# EAGLE design untitled (EAGLE 9.5.2)
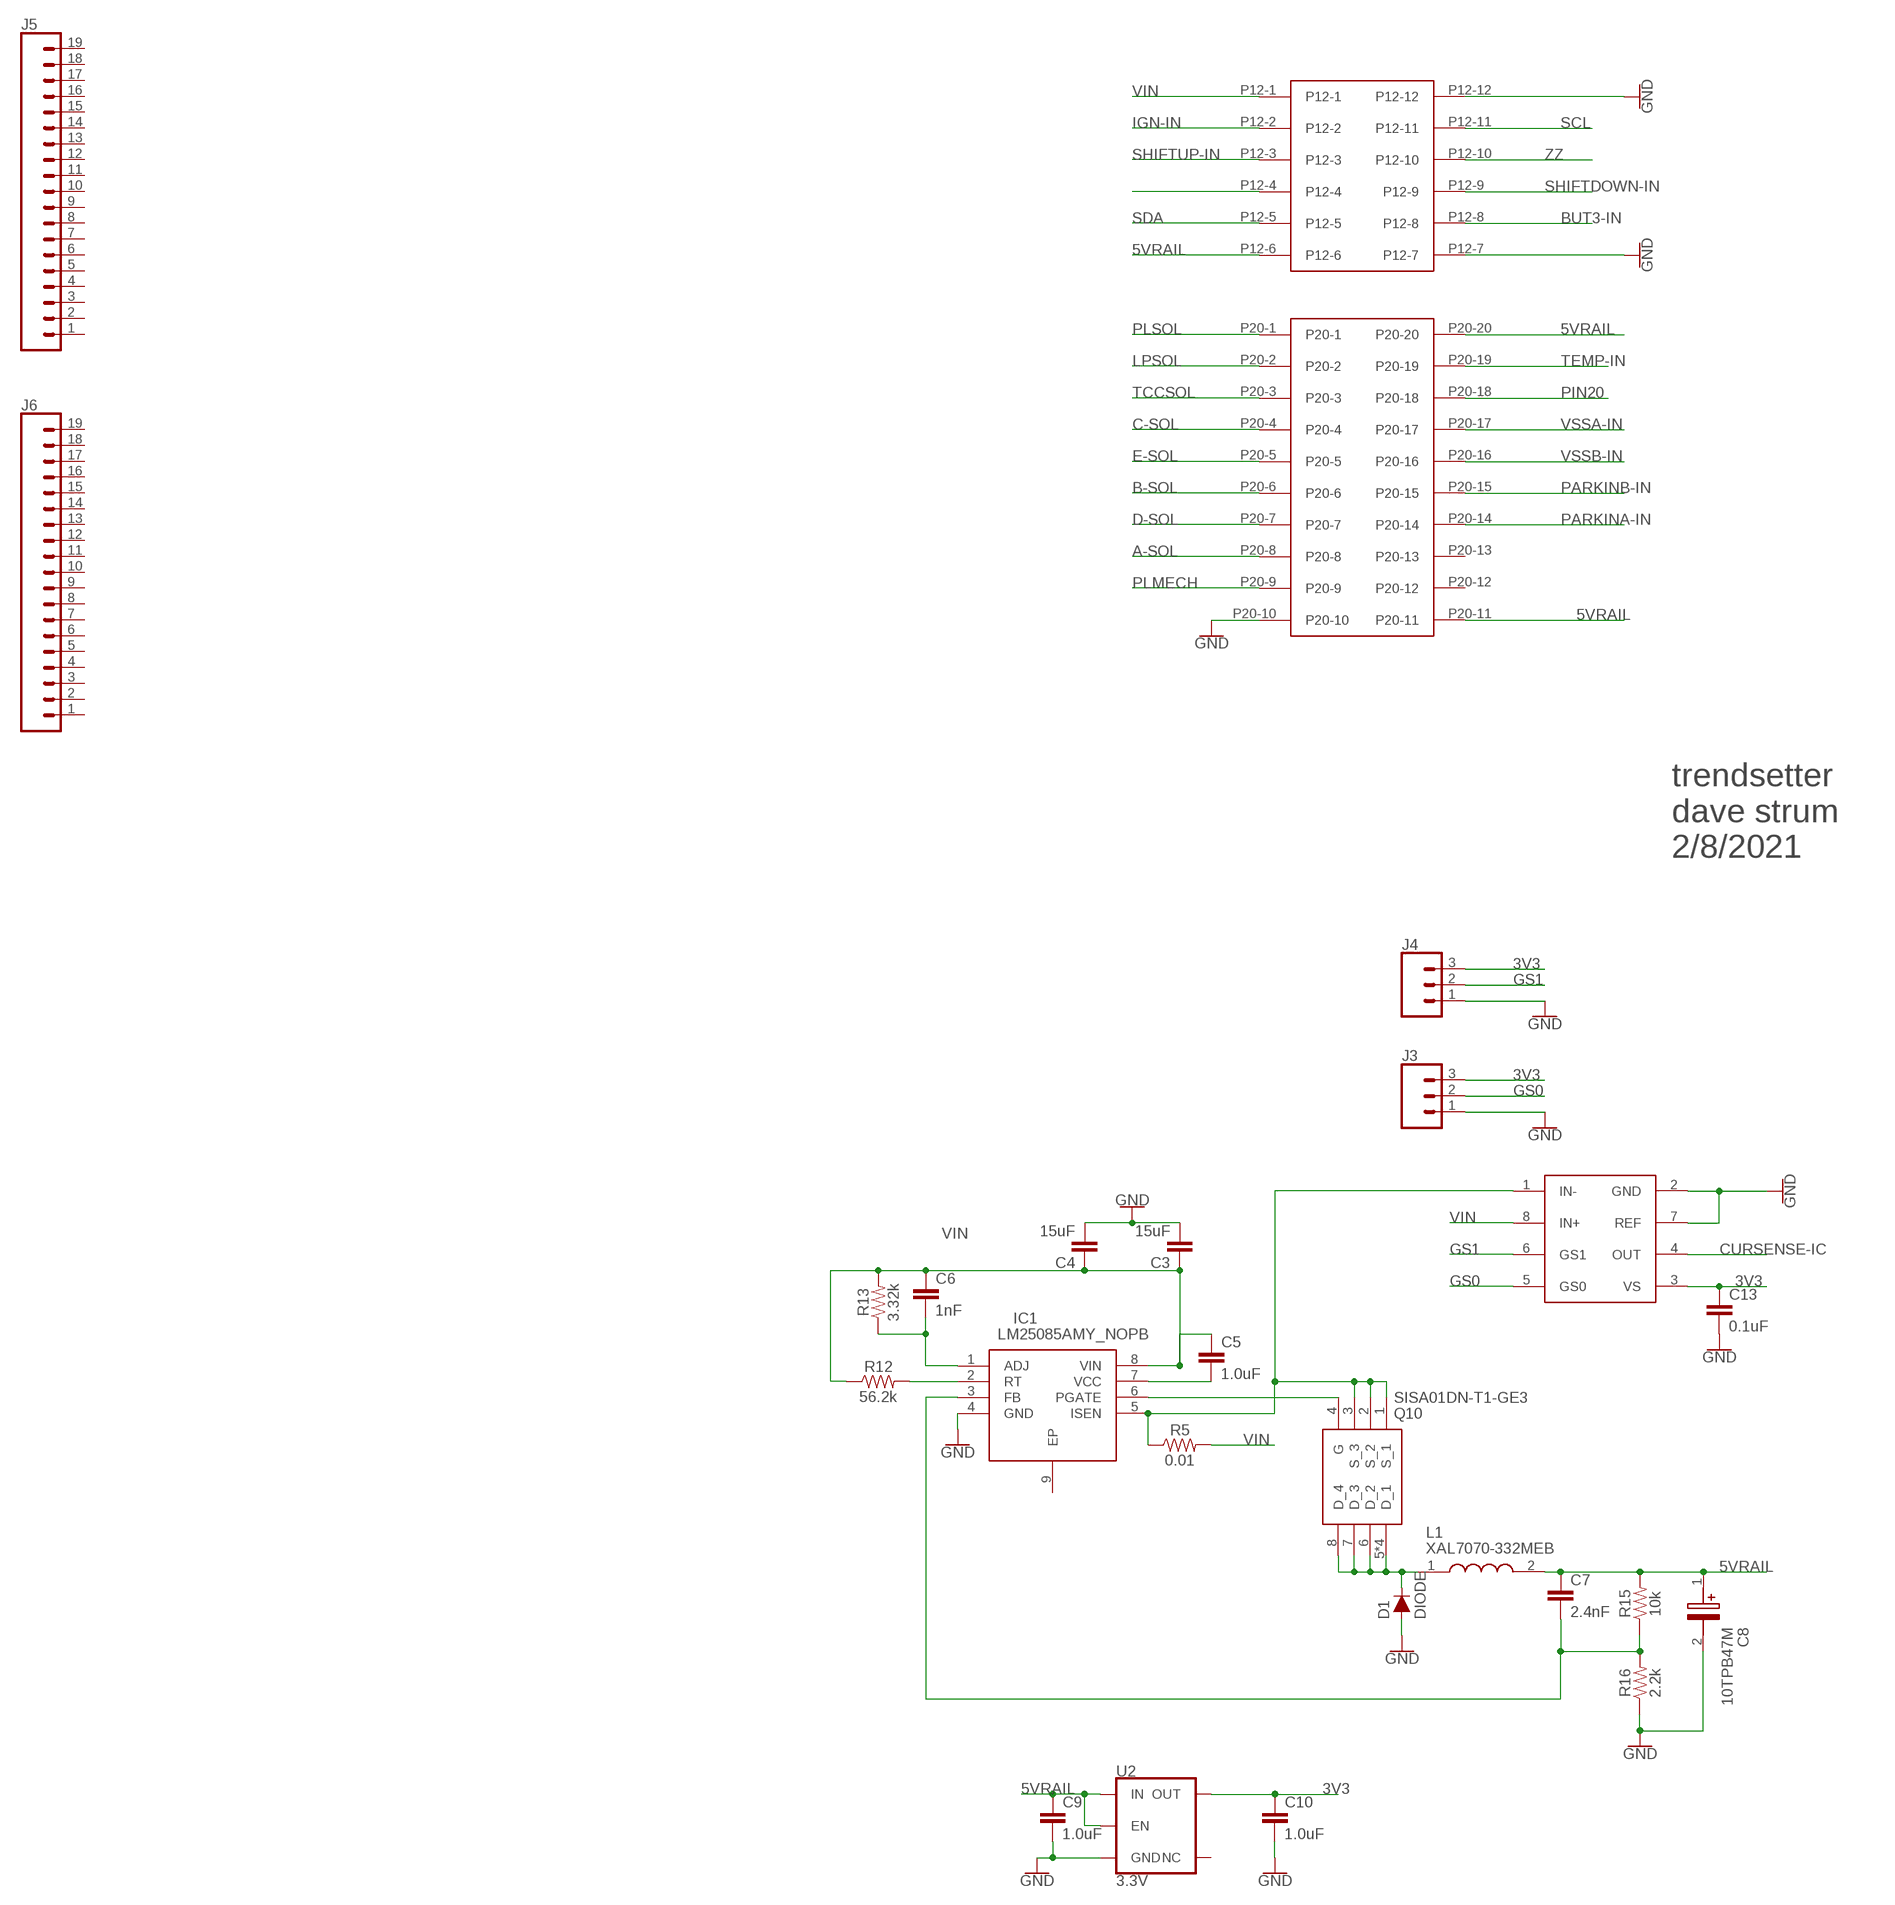
[diagram p0: schematic, sheet 1, part 1 of 2]
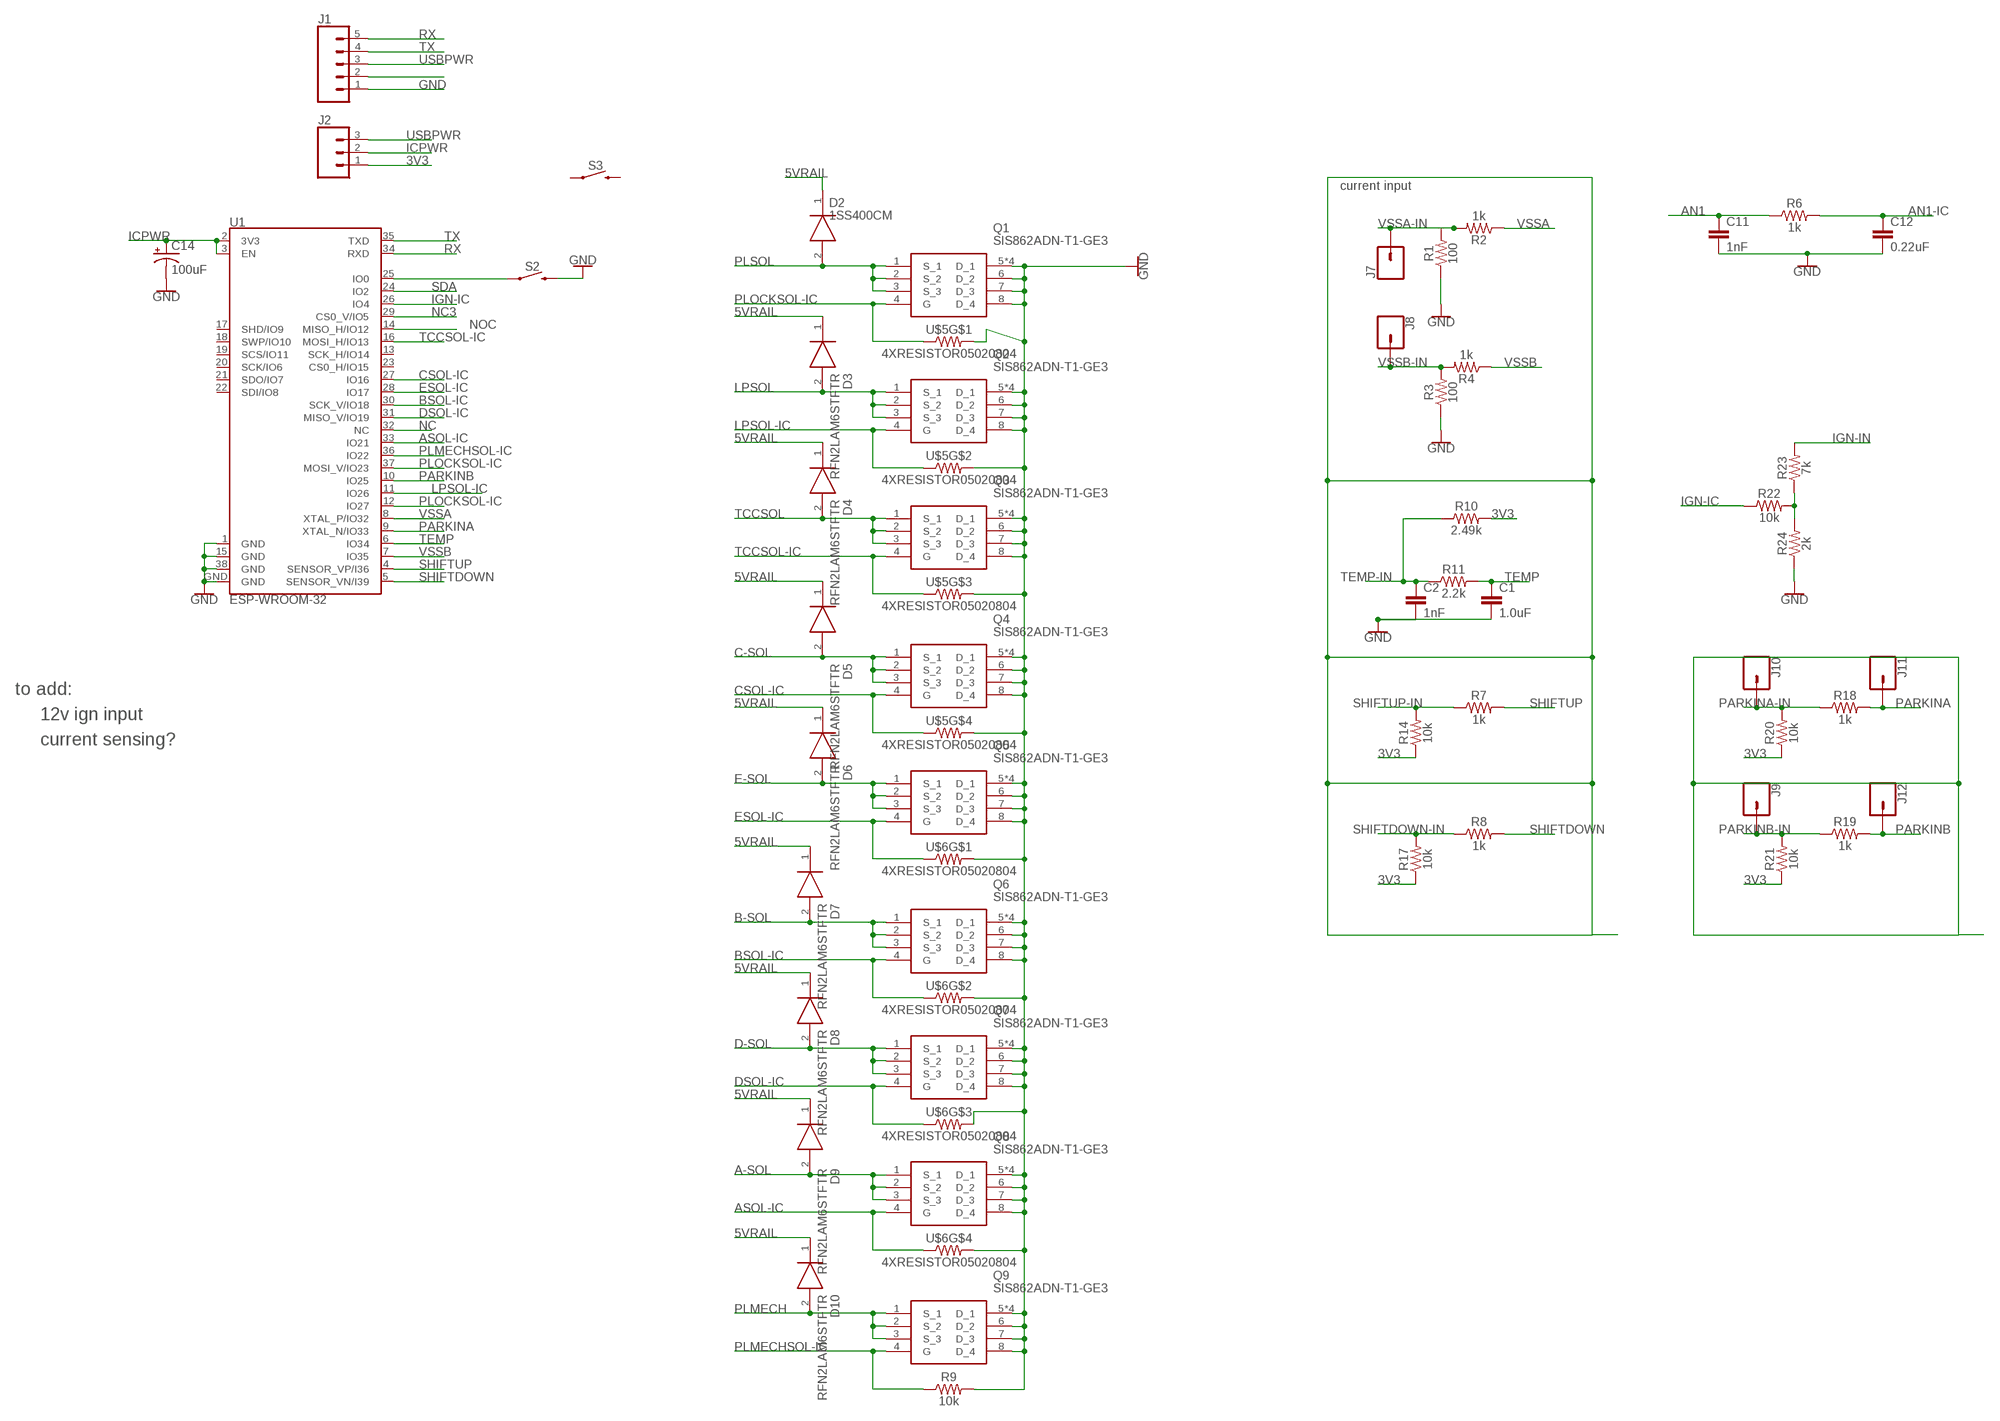
[diagram p1: schematic, sheet 1, part 2 of 2]

## Parts
C1  1.0uF  1.0UF-0603-16V-10%  [0603]
C2  1nF  1.0NF/1000PF-0603-50V-10%  [0603]
C3  15uF  10UF-0805-10V-10%  [0805]
C4  15uF  10UF-0805-10V-10%  [0805]
C5  1.0uF  1.0UF-0603-16V-10%-X7R  [0603]
C6  1nF  1.0NF/1000PF-0603-50V-10%  [0603]
C7  2.4nF  2.2UF-0603-10V-20%  [0603]
C8  10TPB47M  [CAPPM3528X210N]
C9  1.0uF  1.0UF-0603-16V-10%  [0603]
C10  1.0uF  1.0UF-0603-16V-10%  [0603]
C11  1nF  1.0NF/1000PF-0603-50V-10%  [0603]
C12  0.22uF  2.2UF-0603-10V-20%  [0603]
C13  0.1uF  0.1UF-0603-25V-5%  [0603]
C14  100uF  100UF-POLAR-EIA7343-10V-10%(TANT)  [EIA7343]
D1  DIODE  [DPAK]
D2  1SS400CM  RFN2LAM6STFTR  [PMDTM]
D3  RFN2LAM6STFTR  [PMDTM]
D4  RFN2LAM6STFTR  [PMDTM]
D5  RFN2LAM6STFTR  [PMDTM]
D6  RFN2LAM6STFTR  [PMDTM]
D7  RFN2LAM6STFTR  [PMDTM]
D8  RFN2LAM6STFTR  [PMDTM]
D9  RFN2LAM6STFTR  [PMDTM]
D10  RFN2LAM6STFTR  [PMDTM]
IC1  LM25085AMY_NOPB  [SOP65P490X109-9N]
J1  CONN_05  [1X05]
J2  CONN_03LOCK_NO_SILK  [1X03_LOCK_NO_SILK]
J3  CONN_03LOCK_NO_SILK  [1X03_LOCK_NO_SILK]
J4  CONN_03LOCK_NO_SILK  [1X03_LOCK_NO_SILK]
J5  CONN_191X19_NO_SILK  [1X19_NO_SILK]
J6  CONN_191X19_NO_SILK  [1X19_NO_SILK]
J7  CONN_01PTH_NO_SILK_KIT  [1X01NS_KIT]
J8  CONN_01PTH_NO_SILK_KIT  [1X01NS_KIT]
J9  CONN_01PTH_NO_SILK_KIT  [1X01NS_KIT]
J10  CONN_01PTH_NO_SILK_KIT  [1X01NS_KIT]
J11  CONN_01PTH_NO_SILK_KIT  [1X01NS_KIT]
J12  CONN_01PTH_NO_SILK_KIT  [1X01NS_KIT]
L1  XAL7070-332MEB  [XAL7070332MEB]
Q1  SIS862ADN-T1-GE3  [SIS862DNT1GE3]
Q2  SIS862ADN-T1-GE3  [SIS862DNT1GE3]
Q3  SIS862ADN-T1-GE3  [SIS862DNT1GE3]
Q4  SIS862ADN-T1-GE3  [SIS862DNT1GE3]
Q5  SIS862ADN-T1-GE3  [SIS862DNT1GE3]
Q6  SIS862ADN-T1-GE3  [SIS862DNT1GE3]
Q7  SIS862ADN-T1-GE3  [SIS862DNT1GE3]
Q8  SIS862ADN-T1-GE3  [SIS862DNT1GE3]
Q9  SIS862ADN-T1-GE3  [SIS862DNT1GE3]
Q10  SISA01DN-T1-GE3  [SIS862DNT1GE3]
R1  100  1KOHM-0603-1/10W-1%  [0603]
R2  1k  1KOHM-0603-1/10W-1%  [0603]
R3  100  1KOHM-0603-1/10W-1%  [0603]
R4  1k  1KOHM-0603-1/10W-1%  [0603]
R5  0.01  0.05OHM-2512-3W-1%  [2512]
R6  1k  1KOHM-0603-1/10W-1%  [0603]
R7  1k  1KOHM-0603-1/10W-1%  [0603]
R8  1k  1KOHM-0603-1/10W-1%  [0603]
R9  10k  10KOHM-0603-1/10W-1%  [0603]
R10  2.49k  10KOHM-0603-1/10W-1%  [0603]
R11  2.2k  10KOHM-0603-1/10W-1%  [0603]
R12  56.2k  10KOHM-0603-1/10W-1%  [0603]
R13  3.32k  10KOHM-0603-1/10W-1%  [0603]
R14  10k  10KOHM-0603-1/10W-1%  [0603]
R15  10k  2.2KOHM-0603-1/10W-1%  [0603]
R16  2.2k  2.2KOHM-0603-1/10W-1%  [0603]
R17  10k  10KOHM-0603-1/10W-1%  [0603]
R18  1k  1KOHM-0603-1/10W-1%  [0603]
R19  1k  1KOHM-0603-1/10W-1%  [0603]
R20  10k  10KOHM-0603-1/10W-1%  [0603]
R21  10k  10KOHM-0603-1/10W-1%  [0603]
R22  10k  1KOHM-0603-1/10W-1%  [0603]
R23  7k  1KOHM-0603-1/10W-1%  [0603]
R24  2k  1KOHM-0603-1/10W-1%  [0603]
S2  MOMENTARY-SWITCH-SPST-SMD-4.6X2.8MM  [TACTILE_SWITCH_SMD_4.6X2.8MM]
S3  MOMENTARY-SWITCH-SPST-SMD-4.6X2.8MM  [TACTILE_SWITCH_SMD_4.6X2.8MM]
U1  ESP-WROOM-32  [ESP-WROOM-32]
U2  3.3V  V_REG_AP2112K-3.3V  [SOT23-5]
U$1  MODICEMEMX32  [MODICEMEMX32]
U$4  INA229  [MSOP8]
U$5  4XRESISTOR05020804  [4XRESISTOR0804]
U$6  4XRESISTOR05020804  [4XRESISTOR0804]

## Nets
3V3: C10.1 C13.1 J2.1 J3.3 J4.3 R10.2 R14.1 R17.1 R20.1 R21.1 U2.5(OUT) U$4.3(VS)
5VRAIL: C7.1 C8.1(+) C9.1 D2.1(K) D3.1(K) D4.1(K) D5.1(K) D6.1(K) D7.1(K) D8.1(K) D9.1(K) D10.1(K) L1.2 R15.2 U2.1(IN) U2.3(EN) U$1.P12-6 U$1.P20-11 U$1.P20-20
A-SOL: D9.2(A) Q8.1(S_1) Q8.2(S_2) Q8.3(S_3) U$1.P20-8
AN1: C11.1 R6.1
AN1-IC: C12.1 R6.2
ASOL-IC: Q8.4(G) U1.33(IO21) U$6.P$7
B-SOL: D7.2(A) Q6.1(S_1) Q6.2(S_2) Q6.3(S_3) U$1.P20-6
BSOL-IC: Q6.4(G) U1.30(SCK_V/IO18) U$6.P$3
BUT3-IN: U$1.P12-8
C-SOL: D5.2(A) Q4.1(S_1) Q4.2(S_2) Q4.3(S_3) U$1.P20-4
CSOL-IC: Q4.4(G) U1.27(IO16) U$5.P$7
CURSENSE-IC: U$4.4(OUT)
D-SOL: D8.2(A) Q7.1(S_1) Q7.2(S_2) Q7.3(S_3) U$1.P20-7
DSOL-IC: Q7.4(G) U1.31(MISO_V/IO19) U$6.P$5
E-SOL: D6.2(A) Q5.1(S_1) Q5.2(S_2) Q5.3(S_3) U$1.P20-5
ESOL-IC: Q5.4(G) U1.28(IO17) U$6.P$1
GND: C1.2 C2.2 C3.2 C4.2 C8.2(-) C9.2 C10.2 C11.2 C12.2 C13.2 C14.C(-) D1.1(A) D1.3(A) IC1.4(GND) J1.1 J3.1 J4.1 Q1.5(D_1) Q1.6(D_2) Q1.7(D_3) Q1.8(D_4) Q1.9(D_1) Q1.10(D_1) Q1.11(D_1) Q2.5(D_1) Q2.6(D_2) Q2.7(D_3) Q2.8(D_4) Q2.9(D_1) Q2.10(D_1) Q2.11(D_1) Q3.5(D_1) Q3.6(D_2) Q3.7(D_3) Q3.8(D_4) Q3.9(D_1) Q3.10(D_1) Q3.11(D_1) Q4.5(D_1) Q4.6(D_2) Q4.7(D_3) Q4.8(D_4) Q4.9(D_1) Q4.10(D_1) Q4.11(D_1) Q5.5(D_1) Q5.6(D_2) Q5.7(D_3) Q5.8(D_4) Q5.9(D_1) Q5.10(D_1) Q5.11(D_1) Q6.5(D_1) Q6.6(D_2) Q6.7(D_3) Q6.8(D_4) Q6.9(D_1) Q6.10(D_1) Q6.11(D_1) Q7.5(D_1) Q7.6(D_2) Q7.7(D_3) Q7.8(D_4) Q7.9(D_1) Q7.10(D_1) Q7.11(D_1) Q8.5(D_1) Q8.6(D_2) Q8.7(D_3) Q8.8(D_4) Q8.9(D_1) Q8.10(D_1) Q8.11(D_1) Q9.5(D_1) Q9.6(D_2) Q9.7(D_3) Q9.8(D_4) Q9.9(D_1) Q9.10(D_1) Q9.11(D_1) R1.1 R3.1 R9.2 R16.1 R24.1 S2.3 S2.4 U1.1(GND) U1.15(GND) U1.38(GND) U1.GND U2.2(GND) U$1.P12-7 U$1.P12-12 U$1.P20-10 U$4.2(GND) U$4.7(REF) U$5.P$2 U$5.P$4 U$5.P$6 U$5.P$8 U$6.P$2 U$6.P$4 U$6.P$6 U$6.P$8
GS0: J3.2 U$4.5(GS0)
GS1: J4.2 U$4.6(GS1)
ICPWR: C14.A(+) J2.2 U1.2(3V3) U1.3(EN)
IGN-IC: R22.1 U1.26(IO4)
IGN-IN: R23.2 U$1.P12-2
LPSOL: D3.2(A) Q2.1(S_1) Q2.2(S_2) Q2.3(S_3) U$1.P20-2
LPSOL-IC: Q2.4(G) U1.11(IO26) U$5.P$3
N$1: S2.1 S2.2 U1.25(IO0)
N$4: U$1.P12-4
N$6: J1.2
N$7: R22.2 R23.1 R24.2
N$11: IC1.2(RT) R12.2
N$24: C5.2 IC1.7(VCC)
N$25: C6.2 IC1.1(ADJ) R13.1
N$26: IC1.5(ISEN) Q10.1(S_1) Q10.2(S_2) Q10.3(S_3) R5.P$1 U$4.1(IN-)
N$27: IC1.6(PGATE) Q10.4(G)
N$28: D1.4(C) L1.1 Q10.5(D_1) Q10.6(D_2) Q10.7(D_3) Q10.8(D_4) Q10.9(D_1) Q10.10(D_1) Q10.11(D_1)
N$29: C7.2 IC1.3(FB) R15.1 R16.2
NC: U1.32(NC)
NC3: U1.29(CS0_V/IO5)
NOC: U1.14(MISO_H/IO12)
PARKINA: J11.1 R18.2 U1.9(XTAL_N/IO33)
PARKINA-IN: J10.1 R18.1 R20.2 U$1.P20-14
PARKINB: J12.1 R19.2 U1.10(IO25)
PARKINB-IN: J9.1 R19.1 R21.2 U$1.P20-15
PIN20: U$1.P20-18
PLMECH: D10.2(A) Q9.1(S_1) Q9.2(S_2) Q9.3(S_3) U$1.P20-9
PLMECHSOL-IC: Q9.4(G) R9.1 U1.36(IO22)
PLOCKSOL-IC: Q1.4(G) U1.12(IO27) U1.37(MOSI_V/IO23) U$5.P$1
PLSOL: D2.2(A) Q1.1(S_1) Q1.2(S_2) Q1.3(S_3) U$1.P20-1
RX: J1.5 U1.34(RXD)
SCL: U$1.P12-11
SDA: U1.24(IO2) U$1.P12-5
SHIFTDOWN: R8.2 U1.5(SENSOR_VN/I39)
SHIFTDOWN-IN: R8.1 R17.2 U$1.P12-9
SHIFTUP: R7.2 U1.4(SENSOR_VP/I36)
SHIFTUP-IN: R7.1 R14.2 U$1.P12-3
TCCSOL: D4.2(A) Q3.1(S_1) Q3.2(S_2) Q3.3(S_3) U$1.P20-3
TCCSOL-IC: Q3.4(G) U1.16(MOSI_H/IO13) U$5.P$5
TEMP: C1.1 R11.2 U1.6(IO34)
TEMP-IN: C2.1 R10.1 R11.1 U$1.P20-19
TX: J1.4 U1.35(TXD)
USBPWR: J1.3 J2.3
VIN: C3.1 C4.1 C5.1 C6.1 IC1.8(VIN) R5.P$2 R12.1 R13.2 U$1.P12-1 U$4.8(IN+)
VSSA: R2.1 U1.8(XTAL_P/IO32)
VSSA-IN: J7.1 R1.2 R2.2 U$1.P20-17
VSSB: R4.1 U1.7(IO35)
VSSB-IN: J8.1 R3.2 R4.2 U$1.P20-16
ZZ: U$1.P12-10
Unconnected: IC1.9(EP) J5.1 J5.2 J5.3 J5.4 J5.5 J5.6 J5.7 J5.8 J5.9 J5.10 J5.11 J5.12 J5.13 J5.14 J5.15 J5.16 J5.17 J5.18 J5.19 J6.1 J6.2 J6.3 J6.4 J6.5 J6.6 J6.7 J6.8 J6.9 J6.10 J6.11 J6.12 J6.13 J6.14 J6.15 J6.16 J6.17 J6.18 J6.19 S3.1 S3.2 S3.3 S3.4 U1.13(SCK_H/IO14) U1.17(SHD/IO9) U1.18(SWP/IO10) U1.19(SCS/IO11) U1.20(SCK/IO6) U1.21(SDO/IO7) U1.22(SDI/IO8) U1.23(CS0_H/IO15) U2.4(NC) U$1.P20-12 U$1.P20-13

## Notes on the sheet
- current input
- trendsetter
  dave strum
  2/8/2021
- to add:
- 12v ign input
- current sensing?

## Library data of the parts
C1 C9 C10 = SparkFun-Capacitors:1.0UF: 1µF ceramic capacitors A capacitor is a passive two-terminal electrical component used to store electrical energy temporarily in an electric field.; PROD_ID: CAP-00868
C2 C6 C11 = SparkFun-Capacitors:1.0NF/1000PF: 1nF/1,000pF ceramic capacitors A capacitor is a passive two-terminal electrical component used to store electrical energy temporarily in an electric field.; PROD_ID: CAP-07886
C3 C4 = SparkFun-Capacitors:10UF: 10.0µF ceramic capacitors A capacitor is a passive two-terminal electrical component used to store electrical energy temporarily in an electric field.; PROD_ID: CAP-11330; VALUE: 10uF
C5 = SparkFun-Capacitors:1.0UF: 1µF ceramic capacitors A capacitor is a passive two-terminal electrical component used to store electrical energy temporarily in an electric field.; PROD_ID: CAP-13930
C7 C12 = SparkFun-Capacitors:2.2UF: 2.2µF ceramic capacitors A capacitor is a passive two-terminal electrical component used to store electrical energy temporarily in an electric field.; PROD_ID: CAP-07888; VALUE: 2.2uF
C8 = SamacSys_Parts:10TPB47M: Panasonic Tantalum Capacitor 47uF 10V dc Polymer Solid +/-20% Tolerance POSCAP TPB Series Source: Datasheet <https://componentsearchengine.com/Datasheets/1/10TPB47M.pdf>; DESCRIPTION: Panasonic Tantalum Capacitor 47uF 10V dc Polymer Solid +/-20% Tolerance POSCAP TPB Series; HEIGHT: 2.1mm; MANUFACTURER_NAME: Panasonic; MANUFACTURER_PART_NUMBER: 10TPB47M; MOUSER_PART_NUMBER: 667-10TPB47M; MOUSER_PRICE-STOCK: https://www.mouser.com/Search/Refine.aspx?Keyword=667-10TPB47M
C13 = SparkFun-Capacitors:0.1UF: 0.1µF ceramic capacitors A capacitor is a passive two-terminal electrical component used to store electrical energy temporarily in an electric field.; PROD_ID: CAP-08604
C14 = SparkFun-Capacitors:100UF-POLAR: 100µF polarized capacitors A capacitor is a passive two-terminal electrical component used to store electrical energy temporarily in an electric field.; PROD_ID: CAP-07890
D1 = SparkFun-DiscreteSemi:DIODE: Diode These are standard reverse protection diodes and small signal diodes. SparkFun Products: SparkFun SparkPunk Sound Kit <https://www.sparkfun.com/products/11177> SparkFun ESP8266 Thing <https://www.sparkfun.com/products/13231>
D2-D10 = SamacSys_Parts:RFN2LAM6STFTR: ROHM - RFN2LAM6STFTR - RECTIFIER, AEC-Q101, 1.5A, 600V, SOD-128 Source: Datasheet <https://www.rohm.com/datasheet/RFN2LAM6STF/rfn2lam6stf-e>; DESCRIPTION: ROHM - RFN2LAM6STFTR - RECTIFIER, AEC-Q101, 1.5A, 600V, SOD-128; HEIGHT: mm; MANUFACTURER_NAME: ROHM Semiconductor; MANUFACTURER_PART_NUMBER: RFN2LAM6STFTR; MOUSER_PART_NUMBER: 755-RFN2LAM6STFTR; MOUSER_PRICE-STOCK: https://www.mouser.co.uk/ProductDetail/ROHM-Semiconductor/RFN2LAM6STFTR?qs=HXFqYaX1Q2zQE3rPvAAEDA%3D%3D
IC1 = SamacSys_Parts:LM25085AMY_NOPB: Switching Controllers 4.5-42V Wide Vin, Constant On-Time Non-Synchronous PFET Buck Controller with 0.9V Reference 8-MSOP-PowerPAD -40 to 125 Source: Datasheet <http://www.ti.com/lit/ds/symlink/lm25085a.pdf>; DESCRIPTION: Switching Controllers 4.5-42V Wide Vin, Constant On-Time Non-Synchronous PFET Buck Controller with 0.9V Reference 8-MSOP-PowerPAD -40 to 125; HEIGHT: 1.09mm; MANUFACTURER_NAME: Texas Instruments; MANUFACTURER_PART_NUMBER: LM25085AMY/NOPB; MOUSER_PART_NUMBER: 926-LM25085AMY/NOPB; MOUSER_PRICE-STOCK: https://www.mouser.co.uk/ProductDetail/Texas-Instruments/LM25085AMY-NOPB?qs=X1J7HmVL2ZGzco9bZZYcpw%3D%3D
J1 = SparkFun-Connectors:CONN_05: Multi connection point. Often used as Generic Header-pin footprint for 0.1 inch spaced/style header connections On any of the 0.1 inch spaced packages, you can populate with these: Break Away Headers - Straight <https://www.sparkfun.com/products/116> (PRT-00116) Break Away Male Headers - Right Angle <https://www.sparkfun.com/products/553> (PRT-00553) Female Headers <https://www.sparkfun.com/products/115> (PRT-00115) Break Away Headers - Machine Pin <https://www.sparkfun.com/products/117> (PRT-00117) Break Away Female Headers - Swiss Machine Pin <https://www.sparkfun.com/products/743> (PRT-00743) For SCREWTERMINALS and SPRING TERMINALS visit here: Screw Terimnals on SparkFun.com <https://www.sparkfun.com/search/results?term=Screw+Terminals> (5mm/3.5mm/2.54mm spacing) This device is also useful as a general connection point to wire up your design to another part of your project. Our various solder wires solder well into these plated through hole pads. Hook-Up Wire - Assortment (Stranded, 22 AWG) <https://www.sparkfun.com/products/11375> (PRT-11375) Hook-Up Wire - Assortment (Solid Core, 22 AWG) <https://www.sparkfun.com/products/11367> (PRT-11367) View the entire wire category on our website here <https://www.sparkfun.com/categories/141> Special notes: Molex polarized connector foot print use with SKU : PRT-08231 with associated crimp pins and housings. 1MM SMD Version SKU: PRT-10208
J2-J4 = SparkFun-Connectors:CONN_03: Multi connection point. Often used as Generic Header-pin footprint for 0.1 inch spaced/style header connections On any of the 0.1 inch spaced packages, you can populate with these: Break Away Headers - Straight <https://www.sparkfun.com/products/116> (PRT-00116) Break Away Male Headers - Right Angle <https://www.sparkfun.com/products/553> (PRT-00553) Female Headers <https://www.sparkfun.com/products/115> (PRT-00115) Break Away Headers - Machine Pin <https://www.sparkfun.com/products/117> (PRT-00117) Break Away Female Headers - Swiss Machine Pin <https://www.sparkfun.com/products/743> (PRT-00743) Stackable Header - 3 Pin (Female, 0.1") <https://www.sparkfun.com/products/13875> (PRT-13875) For SCREWTERMINALS and SPRING TERMINALS visit here: Screw Terimnals on SparkFun.com <https://www.sparkfun.com/search/results?term=Screw+Terminals> (5mm/3.5mm/2.54mm spacing) This device is also useful as a general connection point to wire up your design to another part of your project. Our various solder wires solder well into these plated through hole pads. Hook-Up Wire - Assortment (Stranded, 22 AWG) <https://www.sparkfun.com/products/11375> (PRT-11375) Hook-Up Wire - Assortment (Solid Core, 22 AWG) <https://www.sparkfun.com/products/11367> (PRT-11367) View the entire wire category on our website here <https://www.sparkfun.com/categories/141> Special notes: Molex polarized connector foot print use with SKU : PRT-08232 with associated crimp pins and housings.
J5 J6 = SparkFun-Connectors:CONN_19: Multi connection point. Often used as Generic Header-pin footprint for 0.1 inch spaced/style header connections On any of the 0.1 inch spaced packages, you can populate with these: Break Away Headers - Straight <https://www.sparkfun.com/products/116> (PRT-00116) Break Away Male Headers - Right Angle <https://www.sparkfun.com/products/553> (PRT-00553) Female Headers <https://www.sparkfun.com/products/115> (PRT-00115) Break Away Headers - Machine Pin <https://www.sparkfun.com/products/117> (PRT-00117) Break Away Female Headers - Swiss Machine Pin <https://www.sparkfun.com/products/743> (PRT-00743) For SCREWTERMINALS and SPRING TERMINALS visit here: Screw Terimnals on SparkFun.com <https://www.sparkfun.com/search/results?term=Screw+Terminals> (5mm/3.5mm/2.54mm spacing) This device is also useful as a general connection point to wire up your design to another part of your project. Our various solder wires solder well into these plated through hole pads. Hook-Up Wire - Assortment (Stranded, 22 AWG) <https://www.sparkfun.com/products/11375> (PRT-11375) Hook-Up Wire - Assortment (Solid Core, 22 AWG) <https://www.sparkfun.com/products/11367> (PRT-11367) View the entire wire category on our website here <https://www.sparkfun.com/categories/141> Special notes: Molex polarized connector foot print use with SKU : PRT-08231 with associated crimp pins and housings. 1MM SMD Version SKU: PRT-10208 NOTES ON THE VARIANTS LOCK and LOCK_LONGPADS... This footprint was designed to help hold the alignment of a through-hole component (i.e. 6-pin header) while soldering it into place. You may notice that each hole has been shifted either up or down by 0.005 of an inch from it's more standard position (which is a perfectly straight line). This slight alteration caused the pins (the squares in the middle) to touch the edges of the holes. Because they are alternating, it causes a "brace" to hold the component in place. 0.005 has proven to be the perfect amount of "off-center" position when using our standard breakaway headers. Although looks a little odd when you look at the bare footprint, once you have a header in there, the alteration is very hard to notice. Also,if you push a header all the way into place, it is covered up entirely on the bottom side.
J7-J12 = SparkFun-Connectors:CONN_01: Single connection point. Often used as Generic Header-pin footprint for 0.1 inch spaced/style header connections On any of the 0.1 inch spaced packages, you can populate with these: Break Away Headers - Straight <https://www.sparkfun.com/products/116> (PRT-00116) Break Away Male Headers - Right Angle <https://www.sparkfun.com/products/553> (PRT-00553) Female Headers <https://www.sparkfun.com/products/115> (PRT-00115) Break Away Headers - Machine Pin <https://www.sparkfun.com/products/117> (PRT-00117) Break Away Female Headers - Swiss Machine Pin <https://www.sparkfun.com/products/743> (PRT-00743) This device is also useful as a general connection point to wire up your design to another part of your project. Our various solder wires solder well into these plated through hole pads. Hook-Up Wire - Assortment (Stranded, 22 AWG) <https://www.sparkfun.com/products/11375> (PRT-11375) Hook-Up Wire - Assortment (Solid Core, 22 AWG) <https://www.sparkfun.com/products/11367> (PRT-11367) View the entire wire category on our website here <https://www.sparkfun.com/categories/141> Special notes: SMTSO-256-ET is a "flush mount" nut for a 4-40 screw. We mostly use this on specialty testbeds; it is a nice way to connect hardware to your PCB at an adjustable hieght. Also note, the SNAP packages are for using a snappable style connector. We sell a baggie of snaps and they are also used on two LilyPad designs: Snap Assortment - 30 pack (male and female) <https://www.sparkfun.com/products/11347> (DEV-11347) LilyPad Arduino SimpleSnap <https://www.sparkfun.com/products/10941> (DEV-10941) LilyPad SimpleSnap Protoboard <https://www.sparkfun.com/products/10940> (DEV-10940)
L1 = SamacSys_Parts:XAL7070-332MEB: Fixed Inductors 3.3uH 20% 15.1A 9.42mOhms AEC-Q200 Source: Datasheet <https://www.coilcraft.com/pdfs/xal7070.pdf>; DESCRIPTION: Fixed Inductors 3.3uH 20% 15.1A 9.42mOhms AEC-Q200; HEIGHT: 7mm; MANUFACTURER_NAME: COILCRAFT; MANUFACTURER_PART_NUMBER: XAL7070-332MEB; MOUSER_PART_NUMBER: 994-XAL7070-332MEB; MOUSER_PRICE-STOCK: https://www.mouser.co.uk/ProductDetail/Coilcraft/XAL7070-332MEB?qs=VJjuEbE9QBMT0elo7nmYBg%3D%3D
Q1-Q9 = SamacSys_Parts:SIS862ADN-T1-GE3: N-Channel 60-V (D-S) MOSFET PowerPAK 121 Source: Datasheet <https://componentsearchengine.com/Datasheets/1/SIS862ADN-T1-GE3.pdf>; DESCRIPTION: N-Channel 60-V (D-S) MOSFET PowerPAK 121; HEIGHT: mm; MANUFACTURER_NAME: Vishay; MANUFACTURER_PART_NUMBER: SIS862ADN-T1-GE3; MOUSER_PART_NUMBER: 78-SIS862ADN-T1-GE3; MOUSER_PRICE-STOCK: https://www.mouser.com/Search/Refine.aspx?Keyword=78-SIS862ADN-T1-GE3
Q10 = SamacSys_Parts:SISA01DN-T1-GE3: VISHAY - SISA01DN-T1-GE3 - MOSFET, P-CH, -30V, -60A, POWERPAK 1212 Source: Datasheet <https://componentsearchengine.com/Datasheets/1/SISA01DN-T1-GE3.pdf>; DESCRIPTION: VISHAY - SISA01DN-T1-GE3 - MOSFET, P-CH, -30V, -60A, POWERPAK 1212; HEIGHT: mm; MANUFACTURER_NAME: Vishay; MANUFACTURER_PART_NUMBER: SISA01DN-T1-GE3; MOUSER_PART_NUMBER: 78-SISA01DN-T1-GE3; MOUSER_PRICE-STOCK: https://www.mouser.com/Search/Refine.aspx?Keyword=78-SISA01DN-T1-GE3
R1 R3 R22-R24 = SparkFun-Resistors:1KOHM: 1kΩ resistor A resistor is a passive two-terminal electrical component that implements electrical resistance as a circuit element. Resistors act to reduce current flow, and, at the same time, act to lower voltage levels within circuits. - Wikipedia; PROD_ID: RES-07856; VALUE: 1k
R2 R4 R6-R8 R18 R19 = SparkFun-Resistors:1KOHM: 1kΩ resistor A resistor is a passive two-terminal electrical component that implements electrical resistance as a circuit element. Resistors act to reduce current flow, and, at the same time, act to lower voltage levels within circuits. - Wikipedia; PROD_ID: RES-07856
R5 = SparkFun-Resistors:0.05OHM: 0.05Ω resistor A resistor is a passive two-terminal electrical component that implements electrical resistance as a circuit element. Resistors act to reduce current flow, and, at the same time, act to lower voltage levels within circuits. - Wikipedia; PROD_ID: RES-13771; VALUE: 0.05
R9 R14 R17 R20 R21 = SparkFun-Resistors:10KOHM: 10kΩ resistor A resistor is a passive two-terminal electrical component that implements electrical resistance as a circuit element. Resistors act to reduce current flow, and, at the same time, act to lower voltage levels within circuits. - Wikipedia; PROD_ID: RES-00824
R10-R13 = SparkFun-Resistors:10KOHM: 10kΩ resistor A resistor is a passive two-terminal electrical component that implements electrical resistance as a circuit element. Resistors act to reduce current flow, and, at the same time, act to lower voltage levels within circuits. - Wikipedia; PROD_ID: RES-00824; VALUE: 10k
R15 = SparkFun-Resistors:2.2KOHM: 2.2kΩ resistor A resistor is a passive two-terminal electrical component that implements electrical resistance as a circuit element. Resistors act to reduce current flow, and, at the same time, act to lower voltage levels within circuits. - Wikipedia; PROD_ID: RES-08272; VALUE: 2.2k
R16 = SparkFun-Resistors:2.2KOHM: 2.2kΩ resistor A resistor is a passive two-terminal electrical component that implements electrical resistance as a circuit element. Resistors act to reduce current flow, and, at the same time, act to lower voltage levels within circuits. - Wikipedia; PROD_ID: RES-08272
S2 S3 = SparkFun-Switches:MOMENTARY-SWITCH-SPST: Momentary Switch (Pushbutton) - SPST Normally-open (NO) SPST momentary switches (buttons, pushbuttons). Variants PTH-12MM - 12mm square, through-hole Momentary Pushbutton Switch - 12mm Square <https://www.sparkfun.com/products/9190> (COM-09190) PTH-6.0MM, PTH-6.0MM-KIT - 6.0mm square, through-hole Mini Pushbutton Switch <https://www.sparkfun.com/products/97> (COM-00097) KIT package intended for soldering kit's - only one side of pads' copper is exposed. PTH-RIGHT-ANGLE-KIT - Right-angle, through-hole Right Angle Tactile Button <https://www.sparkfun.com/products/10791> - Used on SparkFun BigTime Watch Kit <https://www.sparkfun.com/products/11734> SMD-12MM - 12mm square, surface-mount Tactile Button - SMD (12mm) <https://www.sparkfun.com/products/12993> (COM-12993) Used on SparkFun PicoBoard <https://www.sparkfun.com/products/11888> SMD-4.5MM - 4.5mm Square Trackball Switch Used on SparkFun Blackberry Trackballer Breakout <https://www.sparkfun.com/products/13169> SMD-4.6MMX2.8MM - 4.60mm x 2.80mm, surface mount Used on SparkFun SAMD21 Mini Breakout <https://www.sparkfun.com/products/13664> SMD-5.2MM, SMD-5.2-REDUNDANT - 5.2mm square, surface-mount Mini Pushbutton Switch - SMD <https://www.sparkfun.com/products/8720> (COM-08720) Used on Arduino Pro Mini <https://www.sparkfun.com/products/11114> REDUNDANT package connects both switch circuits together SMD-6.0X3.5MM - 6.0 x 3.5mm, surface mount Momentary Reset Switch SMD <https://www.sparkfun.com/products/8229> (COM-08229) SMD-6.2MM-TALL - 6.2mm square, surface mount Tactile Button - SMD (6mm) <https://www.sparkfun.com/products/12992> Used on SparkFun Digital Sandbox <https://www.sparkfun.com/products/12651> SMD-RIGHT-ANGLE - Right-angle, surface mount Used on SparkFun Block for Intel® Edison - Arduino <https://www.sparkfun.com/products/13036>; PROD_ID: SWCH-13065
U1 = SparkFun-RF:ESP-WROOM-32; PROD_ID: IC-13849
U2 = SparkFun-IC-Power:V_REG_AP2112: AP2112 - 600mA CMOS LDO Regulator w/ Enable The AP2112 is CMOS process low dropout linear regulator with enable function, the regulator delivers a guaranteed 600mA (min.) continuous load current. Features Output Voltage Accuracy: ±1.5% Output Current: 600mA (Min.) Foldback Short Current Protection: 50mA Enable Function to Turn ON/OFF VOUT Low Dropout Voltage (3.3V): 250mV (Typ.) @IOUT=600mA Excellent Load Regulation: 0.2%/A (Typ.) Excellent Line Regulation: 0.02%/V (Typ.) Low Quiescent Current: 55μA (Typ.) Low Standby Current: 0.01μA (Typ.) Low Output Noise: 50μVRMS PSRR: 100Hz -65dB, 1kHz -65dB OTSD Protection Stable with 1.0μF Flexible Cap: Ceramic, Tantalum and Aluminum Electrolytic Operation Temperature Range: -40°C to 85°C ESD: MM 400V, HBM 4000V; PROD_ID: VREG-12457
U$1 = strum:MODICEMEMX32
U$4 = SparkFun-IC-Power:INA229
U$5 U$6 = strum:4XRESISTOR0502: https://industrial.panasonic.com/cdbs/www-data/pdf/AOC0000/AOC0000C14.pdf EXB18V

## Board
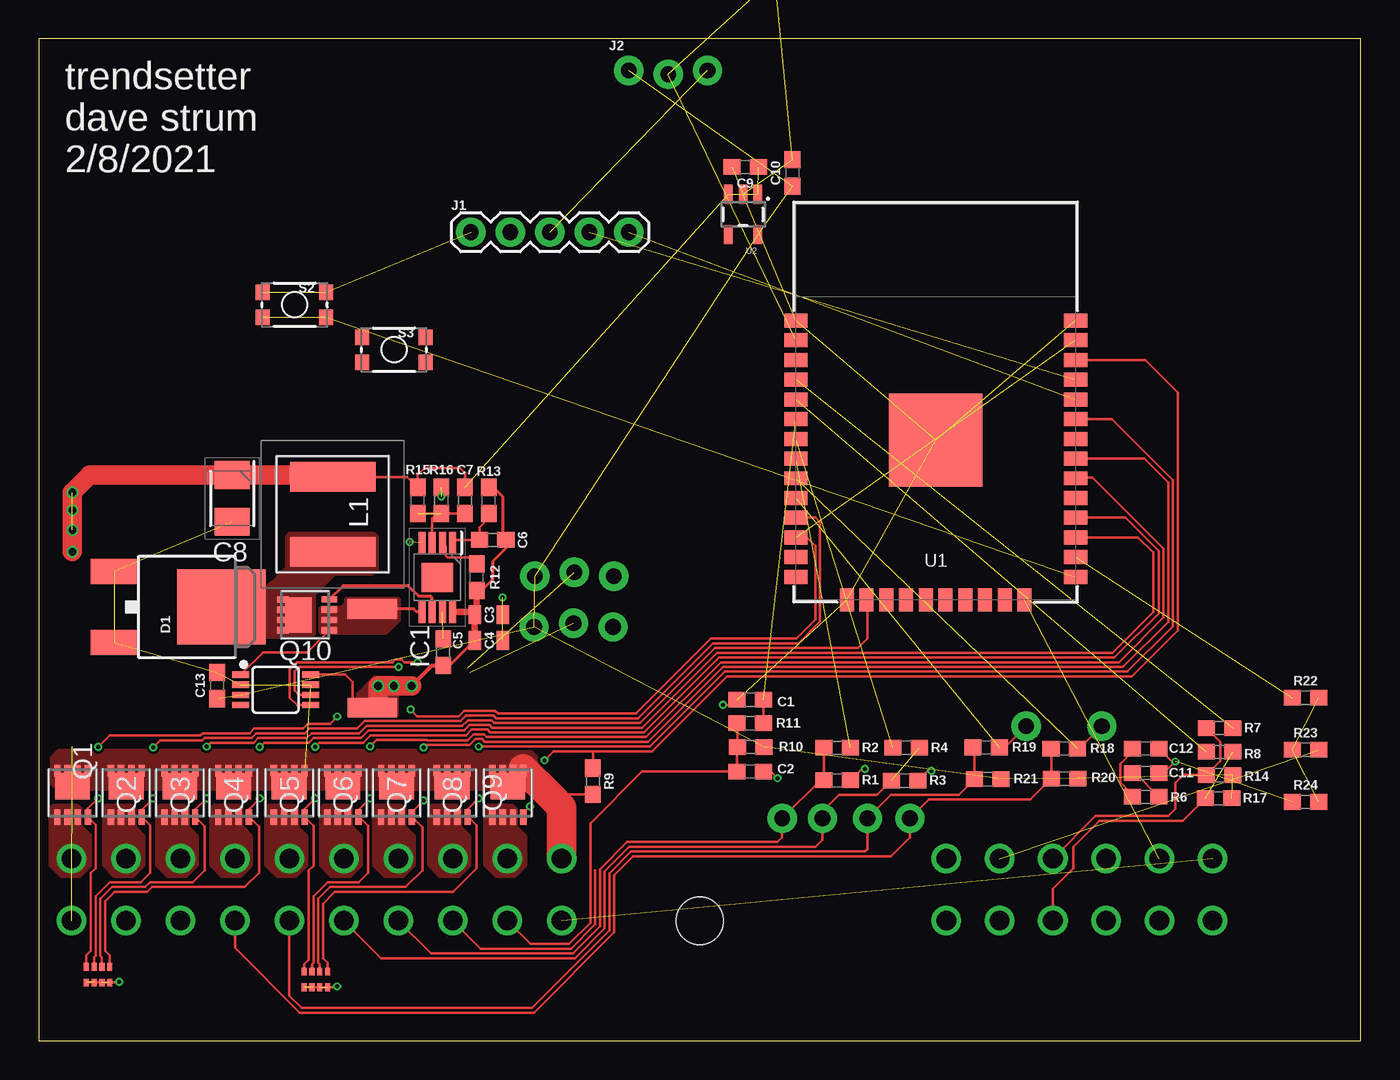
[diagram p2: board, top side]
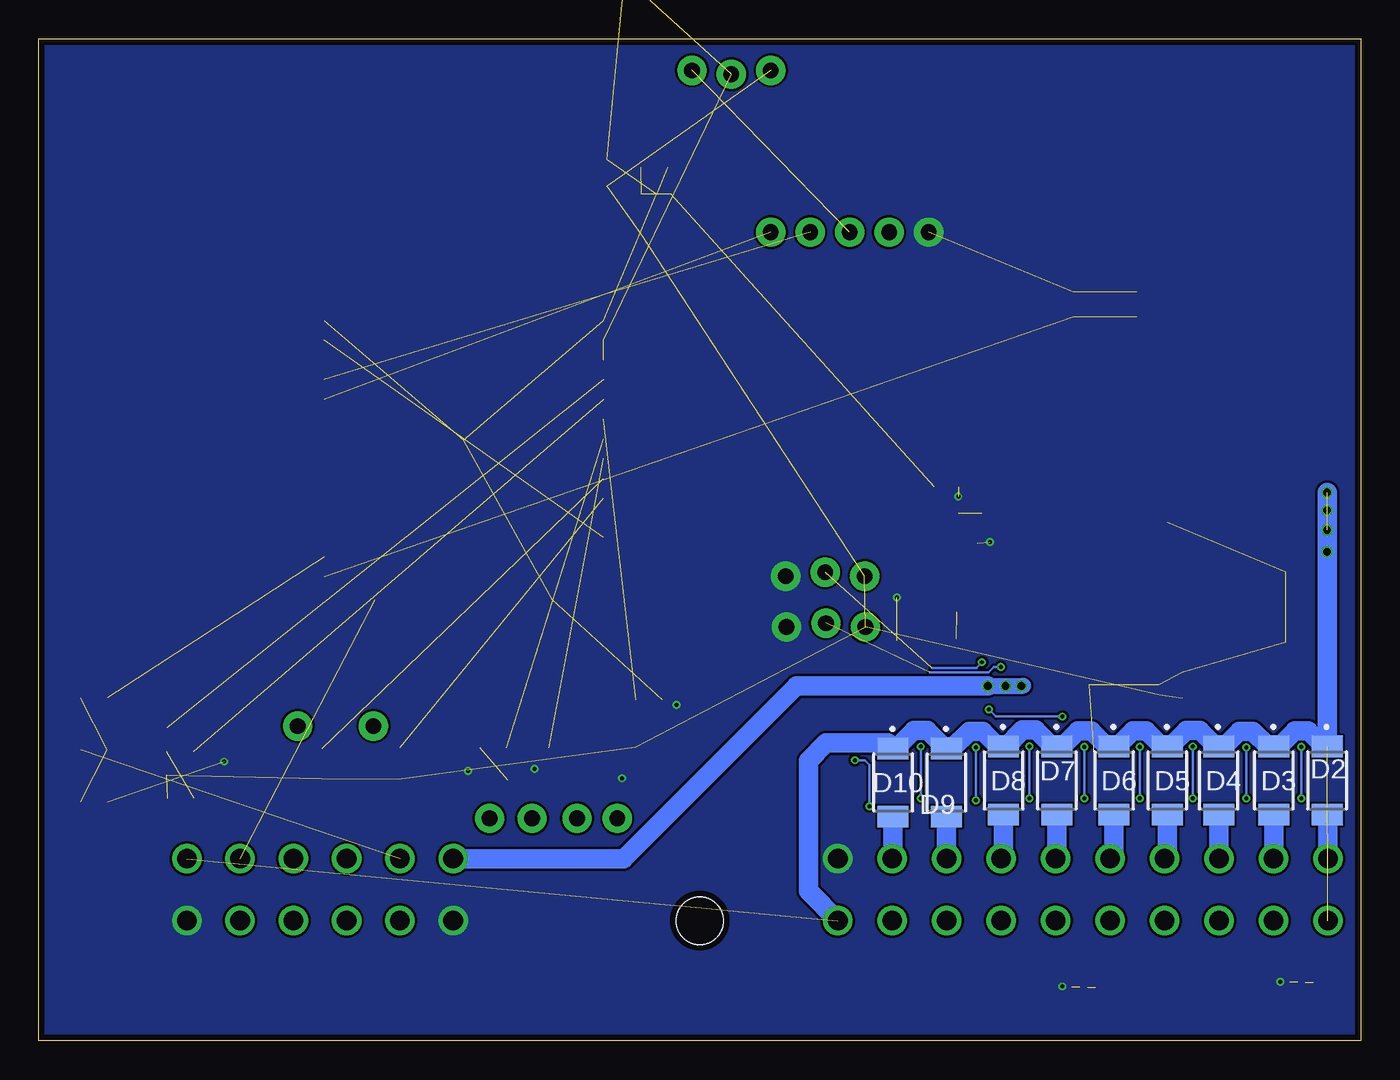
[diagram p3: board, bottom side, seen from below]

Size 85.09 x 64.52 mm. Coordinates in mm from the lower left corner, seen from the top.
Outline: 0,0 85.09,0 85.09,64.52 0,64.52 0,0
Copper layers (1*16): Top 0.035559375mm / dielectric 1.6mm / Bottom 0.035559375mm
Design rules "oshpark-2layer": minimum track width 6mil, minimum drill 10mil, track to track 6mil, track to pad 6mil, pad to pad 6mil, via to via 6mil, smd to smd 6mil, copper to edge 15mil, drill to drill 6mil, minimum pad ring 5mil, minimum via ring 5mil, stop-mask expansion 2.5mil, vias tented up to drill 0mil, thermal gap 10mil

### Footprints (pad centres in the part's own frame; a part is rotated, then mirrored left to right if it is on the bottom)
0603 = smd 1.1 x 1: 1 -0.85,0; 2 0.85,0
0805 = smd 0.8 x 1.2: 1 -0.9,0; 2 0.9,0
CAPPM3528X210N = smd 1.8 x 2.25: 1 -1.5,0; 2 1.5,0
EIA7343 = smd 2.55 x 2.7: A 3.17,0; C -3.17,0
DPAK = smd 1.6 x 3: 1 -2.28,-5.31; 3 2.28,-5.31 | smd 4.826 x 5.715: 4 0,1.588
PMDTM = smd 2 x 1.4: 1 0,-2.2; 2 0,2.2
SOP65P490X109-9N = smd 1.425 x 0.45: 1 -2.212,0.975; 2 -2.212,0.325; 3 -2.212,-0.325; 4 -2.212,-0.975; 5 2.212,-0.975; 6 2.212,-0.325; 7 2.212,0.325; 8 2.212,0.975 | smd 1.88 x 2: 9 0,0
1X05 = drill 1.016 pad 1.88: 1 0,0; 2 2.54,0; 3 5.08,0; 4 7.62,0; 5 10.16,0
1X03_LOCK_NO_SILK = drill 1.016 pad 1.88: 1 0,0.127; 2 2.54,-0.127; 3 5.08,0.127
1X19_NO_SILK = drill 1.016 pad 1.88: 1 0,0; 2 2.54,0; 3 5.08,0; 4 7.62,0; 5 10.16,0; 6 12.7,0; 7 15.24,0; 8 17.78,0; 9 20.32,0; 10 22.86,0; 11 25.4,0; 12 27.94,0; 13 30.48,0; 14 33.02,0; 15 35.56,0; 16 38.1,0; 17 40.64,0; 18 43.18,0; 19 45.72,0
1X01NS_KIT = drill 1.016 pad 1.88: 1 0,0
XAL7070332MEB = smd 1.92 x 5.5: 1 -2.41,0; 2 2.41,0
SIS862DNT1GE3 = smd 0.99 x 0.405: 1 -1.555,0.992; 2 -1.555,0.332; 3 -1.555,-0.328; 4 -1.555,-0.988 | smd 0.51 x 0.405: 5 1.555,-0.988; 6 1.555,-0.328; 7 1.555,0.332; 8 1.555,0.992 | smd 1.725 x 2.235: 9 0.438,0.002 | smd 0.25 x 0.077: 10 1.175,-1.156; 11 1.175,1.156
2512 = smd 1.27 x 3.175: P$1 -3.175,0; P$2 3.175,0
TACTILE_SWITCH_SMD_4.6X2.8MM = smd 0.9 x 1: 1 -2.05,-0.8; 2 2.05,-0.8; 3 2.05,0.8; 4 -2.05,0.8
ESP-WROOM-32 = smd 0.9 x 1.5: 1 7.7,9; 2 6.43,9; 3 5.16,9; 4 3.89,9; 5 2.62,9; 6 1.35,9; 7 0.08,9; 8 -1.19,9; 9 -2.46,9; 10 -3.73,9; 11 -5,9; 12 -6.27,9; 13 -7.54,9; 14 -8.81,9; 25 -8.81,-9; 26 -7.54,-9; 27 -6.27,-9; 28 -5,-9; 29 -3.73,-9; 30 -2.46,-9; 31 -1.19,-9; 32 0.08,-9; 33 1.35,-9; 34 2.62,-9; 35 3.89,-9; 36 5.16,-9; 37 6.43,-9; 38 7.7,-9 | smd 1.5 x 0.9: 15 -10.3,5.715; 16 -10.3,4.445; 17 -10.3,3.175; 18 -10.3,1.905; 19 -10.3,0.635; 20 -10.3,-0.635; 21 -10.3,-1.905; 22 -10.3,-3.175; 23 -10.3,-4.445; 24 -10.3,-5.715 | smd 6 x 6: GND 0,0
SOT23-5 = smd 0.55 x 1.2: 1 -0.95,-1.3; 2 0,-1.3; 3 0.95,-1.3; 4 0.95,1.3; 5 -0.95,1.3
MODICEMEMX32 = drill 1.27: P12-1 -15.875,-3.988; P12-2 -19.304,-3.988; P12-3 -22.733,-3.988; P12-4 -26.162,-3.988; P12-5 -29.591,-3.988; P12-6 -33.02,-3.988; P12-7 -15.875,0; P12-8 -19.304,0; P12-9 -22.733,0; P12-10 -26.162,0; P12-11 -29.591,0; P12-12 -33.02,0; P20-1 40.437,-3.988; P20-2 36.932,-3.988; P20-3 33.426,-3.988; P20-4 29.921,-3.988; P20-5 26.416,-3.988; P20-6 22.911,-3.988; P20-7 19.406,-3.988; P20-8 15.9,-3.988; P20-9 12.395,-3.988; P20-10 8.89,-3.988; P20-11 40.437,0; P20-12 36.932,0; P20-13 33.426,0; P20-14 29.921,0; P20-15 26.416,0; P20-16 22.911,0; P20-17 19.406,0; P20-18 15.9,0; P20-19 12.395,0; P20-20 8.89,0 | hole 3.048: 0,0
MSOP8 = smd 0.4 x 1.1: 1 -0.975,-2.25; 2 -0.325,-2.25; 3 0.325,-2.25; 4 0.975,-2.25; 5 0.975,2.25; 6 0.325,2.25; 7 -0.325,2.25; 8 -0.975,2.25
4XRESISTOR0804 = smd 0.33 x 0.5: P$1 -0.75,0.5; P$2 -0.75,-0.5; P$3 -0.25,0.5; P$4 -0.25,-0.5; P$5 0.25,0.5; P$6 0.25,-0.5; P$7 0.75,0.5; P$8 0.75,-0.5

### Placement (x,y rotation side)
C1  45.8,21.97 180 top
C2  45.8,17.35 0 top
C3  28.96,27.43 0 top
C4  28.96,25.78 0 top
C5  26.04,25.02 90 top
C6  29.21,32.26 180 top
C7  27.43,34.8 270 top
C8  12.45,34.92 270 top
C9  45.47,56.26 180 top
C10  48.51,55.88 90 top
C11  71.25,17.25 0 top
C12  71.25,18.82 0 top
C13  11.48,22.89 90 top
C14  50.04,73.79 0 top  (outside the outline)
D1  10.16,27.94 270 top
D2  2.16,16.76 180 bottom
D3  5.59,16.76 180 bottom
D4  9.14,16.76 180 bottom
D5  12.45,16.76 180 bottom
D6  15.88,16.76 180 bottom
D7  19.56,16.76 180 bottom
D8  22.99,16.76 180 bottom
D9  26.67,16.64 180 bottom
D10  30.1,16.64 180 bottom
IC1  25.65,29.84 270 top
J1  27.81,52.07 0 top
J2  37.97,62.36 0 top
J3  37.01,30.05 180 top
J4  36.96,26.77 180 top
J5  1.78,-55.5 0 top  (outside the outline)
J6  1.78,-58.93 0 top  (outside the outline)
J7  47.85,14.33 0 top
J8  50.44,14.33 0 top
J9  53.34,14.33 0 top
J10  56.08,14.33 0 top
J11  68.43,20.27 0 top
J12  63.55,20.27 0 top
L1  18.92,33.91 90 top
Q1  2.17,15.97 90 top
Q2  5.63,15.97 90 top
Q3  9.08,15.97 90 top
Q4  12.54,15.97 90 top
Q5  16.12,15.97 90 top
Q6  19.57,15.97 90 top
Q7  23.03,15.97 90 top
Q8  26.61,15.97 90 top
Q9  30.19,15.97 90 top
Q10  17.14,27.43 180 top
R1  51.38,16.79 180 top
R2  51.38,18.87 180 top
R3  55.73,16.76 180 top
R4  55.83,18.87 0 top
R5  21.46,24.64 270 top
R6  71.25,15.72 180 top
R7  76,20.14 0 top
R8  76,18.62 180 top
R9  35.66,16.71 270 top
R10  45.82,18.92 0 top
R11  45.8,20.45 0 top
R12  28.19,29.84 90 top
R13  28.96,34.8 90 top
R14  76,17.12 180 top
R15  24.38,34.8 90 top
R16  25.91,34.8 270 top
R17  75.95,15.62 180 top
R18  66.01,18.82 0 top
R19  60.99,18.9 0 top
R20  66.04,16.89 180 top
R21  61.09,16.87 180 top
R22  81.53,22.1 0 top
R23  81.53,18.75 0 top
R24  81.53,15.39 0 top
S2  16.46,47.4 0 top
S3  22.86,44.5 0 top
U1  57.73,38.68 90 top
U2  45.34,53.21 180 top
U$1  42.55,7.75 180 top
U$4  15.24,22.61 270 top
U$5  3.81,4.27 0 top
U$6  17.83,3.96 0 top

### Tracks (layer width: path | path; a pad name or v marks a point on that pad's centre or on a via)
3V3  (11 unrouted)
5VRAIL  (via drill 0.5)  (7 unrouted)
  Top 0.152: C7.1 27.43,36.58 27.13,36.88 24.84,36.88 24.38,36.42 R15.2 23.71,36.32 L1.2
  Top 1.27: L1.2 18.82,36.42 C8.1 3.28,36.42 v2.16,35.31 v2.16,31.5
  Bottom 1.27: U$1.P20-20 35.56,9.65 35.56,18.03 34.42,19.18 30.44,19.18 D10.1 29.91,18.84 28.75,19.99 27.89,19.99 26.74,18.84 D9.1 26.3,18.84 25.2,19.94 24.33,19.94 23.36,18.96 D8.1 22.82,18.96 21.77,20.02 20.91,20.02 19.85,18.96 D7.1 19.21,18.96 18.21,19.96 17.35,19.96 16.35,18.96 D6.1 15.66,18.96 14.65,19.96 13.79,19.96 12.79,18.96 D5.1 12.25,18.96 11.23,19.99 10.36,19.99 9.34,18.96 D4.1 8.77,18.96 7.8,19.94 6.93,19.94 5.96,18.96 D3.1 5.24,18.96 4.24,19.96 3.38,19.96 2.38,18.96 D2.1 v2.16,31.5 v2.16,35.31
  other vias: 2.16,34.16 2.16,32.89
A-SOL
  Bottom 1.27: D9.2 26.67,11.76 U$1.P20-8
  pour Top (no thermals): 27.18,14.99 27.05,15.11 26.92,15.24 25.27,15.24 25.02,14.99 25.02,11.3 25.78,10.54 27.05,10.54 27.69,11.18 27.81,11.3 27.81,11.81 27.81,13.21 27.3,13.72 27.24,13.78 27.24,14.92
AN1
  Top 0.152: R6.1 70.57,17.25 C11.1
AN1-IC
  Top 0.152: R6.2 70.4,15.87 69.62,16.65 69.62,17.84 70.4,18.62 C12.1
ASOL-IC  (via drill 0.25)
  Top 0.152: Q8.4 27.6,14.48 | 27.6,14.48 27.6,14.9 v28.32,15.62 | U$6.P$7 18.58,5.04 18.29,5.33 18.29,8.84 19.05,9.6 26.67,9.6 28.19,11.12 28.19,13.88 27.6,14.48 | v28.32,18.95 39.34,18.95 44.16,23.77 70.07,23.77 73,26.7 73,36.12 69.08,40.03 U1.33
  Bottom 0.152: v28.32,15.62 v28.32,18.95
B-SOL
  Bottom 1.27: D7.2 19.56,11.81 U$1.P20-6
  pour Top (no thermals): 20.19,14.99 20.07,15.11 19.94,15.24 18.29,15.24 18.03,14.99 18.03,11.3 18.8,10.54 20.07,10.54 20.7,11.18 20.83,11.3 20.83,11.81 20.83,13.21 20.32,13.72 20.26,13.78 20.26,14.92
BSOL-IC  (via drill 0.25)
  Top 0.152: Q6.4 20.56,14.48 | 20.56,14.48 20.56,14.85 v21.34,15.62 | v21.34,18.97 21.74,19.38 24.96,19.38 24.99,19.36 27.61,19.36 28,19.74 28.65,19.74 28.82,19.56 39.09,19.56 43.91,24.38 69.52,24.38 72.39,27.26 72.39,31.7 67.82,36.27 66.78,36.27 U1.30 | U$6.P$3 17.58,4.92 17.68,5.02 17.68,9.3 18.59,10.21 20.57,10.21 21.18,10.82 21.18,13.86 20.56,14.48
  Bottom 0.152: v21.34,15.62 v21.34,18.97
C-SOL
  Bottom 1.27: D5.2 12.45,11.91 U$1.P20-4
  pour Top (no thermals): 13.14,14.99 13.02,15.11 12.89,15.24 11.24,15.24 10.99,14.99 10.99,11.3 11.75,10.54 13.02,10.54 13.65,11.18 13.78,11.3 13.78,11.81 13.78,13.21 13.27,13.72 13.21,13.78 13.21,14.92
CSOL-IC  (via drill 0.25)
  Top 0.152: v14.22,15.62 13.53,14.92 Q4.4 14.17,13.77 14.17,10.82 13.26,9.91 7.29,9.91 6.98,9.6 4.88,9.6 4.27,8.99 4.27,5.79 4.56,5.5 U$5.P$7 | v14.22,18.92 14.5,19.2 17.38,19.2 17.68,19.51 20.76,19.51 21.24,19.99 27.39,19.99 27.74,20.34 29.01,20.34 29.18,20.17 38.83,20.17 43.66,24.99 69.11,24.99 71.74,27.62 71.74,31.43 70.76,32.41 U1.27
  Bottom 0.152: v14.22,15.62 v14.22,18.92
D-SOL
  Bottom 1.27: D8.2 22.99,11.89 U$1.P20-7
  pour Top (no thermals): 23.62,14.99 23.5,15.11 23.37,15.24 21.72,15.24 21.46,14.99 21.46,11.3 22.23,10.54 23.5,10.54 24.13,11.18 24.26,11.3 24.26,11.81 24.26,13.21 23.75,13.72 23.69,13.78 23.69,14.92
DSOL-IC  (via drill 0.25)
  Top 0.152: v24.77,15.49 24.02,14.75 Q7.4 24.69,13.74 24.69,10.97 23.62,9.91 18.75,9.91 17.98,9.14 17.98,5.03 18.08,4.93 U$6.P$5 | v24.77,18.9 24.92,19.05 27.74,19.05 28.12,19.43 28.52,19.43 28.7,19.25 39.21,19.25 44.04,24.08 69.8,24.08 72.69,26.98 72.69,35.97 71.17,37.49 U1.31
  Bottom 0.152: v24.77,15.49 v24.77,18.9
E-SOL
  Bottom 1.27: D6.2 15.88,11.99 U$1.P20-5
  pour Top (no thermals): 16.7,14.99 16.57,15.11 16.45,15.24 14.8,15.24 14.54,14.99 14.54,11.3 15.3,10.54 16.57,10.54 17.21,11.18 17.34,11.3 17.34,11.81 17.34,13.21 16.83,13.72 16.76,13.78 16.76,14.92
ESOL-IC  (via drill 0.25)
  Top 0.152: v17.78,15.62 17.11,14.95 Q5.4 17.68,13.85 17.68,11.28 17.37,10.97 17.37,5.21 17.08,4.92 U$6.P$1 | v17.78,18.92 18.06,19.2 20.88,19.2 21.36,19.68 27.51,19.68 27.87,20.04 28.88,20.04 29.06,19.86 38.96,19.86 43.79,24.69 69.24,24.69 72.08,27.54 72.08,31.55 69.95,33.68 U1.28
  Bottom 0.152: v17.78,15.62 v17.78,18.92
GND  (via drill 0.25)  (25 unrouted)
  Top 0.152: R9.2 33.08,15.86 32.96,15.74 | C12.2 72.94,17.98 v73.15,17.98 72.42,17.25 C11.2 | R1.1 52.97,17.53 v53.19,17.53 | R3.1 57.19,17.37 v57.45,17.37 | C2.2 47.12,17.35 v47.55,16.92 | v44.04,21.64 44.62,21.64 C1.2 | v19.2,3.5 19.16,3.46 U$6.P$8 U$6.P$2 | v5.18,3.81 5.14,3.77 U$5.P$8 U$5.P$2
  Top 1.905: U$1.P20-10 33.66,15.05 32.96,15.74 Q9.5
  other vias: 23.88,32.13 25.91,35.05 29.84,28.55
  pour Top: 1.14,16.13 0.76,16.51 0.76,18.29 1.27,18.8 31.62,18.8 32.13,18.29 32.13,16.64 31.62,16.13
  pour Bottom (no thermals): -1.02,65.53 85.98,65.53 86.74,64.77 86.74,0.51 84.58,-1.65 0.38,-1.65 -2.41,1.14 -2.41,63.88 -0.89,65.41
GS0  (via drill 0.25)  (1 unrouted)
  Top 0.152: U$4.5 16.62,21.63 16.15,22.1 16.15,23.93 16.61,24.38 22.79,24.38 22.96,24.56 23.36,24.56 23.54,24.38 v24.38,24.38
  Bottom 0.152: v24.38,24.38 24.74,24.03 27.58,24.03
GS1  (via drill 0.25)  (1 unrouted)
  Top 0.152: U$4.6 16.73,22.28 16.46,22.55 16.46,23.77 16.76,24.08 v23.16,24.08
  Bottom 0.152: v23.16,24.08 23.62,24.08 23.98,23.72 27.74,23.72
ICPWR  (3 unrouted)
IGN-IC  (1 unrouted)
IGN-IN  (1 unrouted)
LPSOL
  Bottom 1.27: D3.2 5.59,11.76 U$1.P20-2
  pour Top (no thermals): 6.22,14.99 6.1,15.11 5.97,15.24 4.32,15.24 4.06,14.99 4.06,11.3 4.83,10.54 6.1,10.54 6.73,11.18 6.86,11.3 6.86,11.81 6.86,13.21 6.35,13.72 6.29,13.78 6.29,14.92
LPSOL-IC  (via drill 0.25)
  Top 0.152: v7.37,15.62 6.62,14.87 Q2.4 7.16,13.87 7.16,10.82 6.55,10.21 4.57,10.21 3.66,9.3 3.66,5.49 3.56,5.39 U$5.P$3 | v7.37,18.9 7.82,19.36 10.52,19.36 10.67,19.51 13.7,19.51 14,19.81 17.12,19.81 17.43,20.12 20.5,20.12 20.99,20.6 27.13,20.6 27.49,20.95 29.26,20.95 29.44,20.78 38.58,20.78 43.41,25.6 48.89,25.6 50.29,27 50.29,33.38 49.98,33.68 U1.11
  Bottom 0.152: v7.37,15.62 v7.37,18.9
N$1  (2 unrouted)
N$7  (2 unrouted)
N$11
  Top 0.152: IC1.2 26.18,31.86 26.18,31.25 26.31,31.12 26.67,31.12 26.67,31.11 27.77,31.11 R12.2
N$24  (1 unrouted)
N$25
  Top 0.152: IC1.1 26.83,32.26 C6.2 28.36,33.06 28.96,33.66 R13.1
N$26
  Top 0.152: U$4.1 14.43,25.02 17.28,25.02 Q10.1
  Top 0.203: IC1.5 24.31,27.63 24.13,27.81 R5.P$1
  pour Top (no thermals): 18.16,28 19.49,28 19.68,28.19 19.68,28.45 19.81,28.57 23.11,28.57 23.24,28.45 23.24,27.05 23.11,26.92 22.35,26.16 22.23,26.16 18.16,26.16 18.03,26.29 18.03,27.88
N$27
  Top 0.152: 25.27,27.69 IC1.6
  Top 0.203: Q10.4 19.62,29.34 23.75,29.34 24.43,28.65 25.2,28.65 25.27,28.57 25.27,27.69
N$28
  pour Top (no thermals): 21.84,32.51 21.84,30.35 21.46,29.97 19.05,29.97 17.78,28.7 17.78,26.16 17.53,25.91 14.22,25.91 14.1,26.04 14.1,28.7 15.88,30.48 15.88,32.51 16.13,32.77 21.59,32.77
N$29  (1 unrouted)
  Top 0.152: C7.2 25.65,33.95 | 25.65,33.95 R15.1 | IC1.3 25.33,33.62 25.65,33.95
PARKINA  (1 unrouted)
  Top 0.152: J11.1 66.98,18.82 R18.2
PARKINA-IN
  Top 0.152: R18.1 65.19,18.8 R20.2 63.84,15.54 57.3,15.54 J10.1 56.08,13.11 54.86,11.89 38.25,11.89 37.03,10.67 37.03,6.99 31.87,1.83 16.79,1.83 12.62,6 U$1.P20-14
PARKINB  (1 unrouted)
  Top 0.152: J12.1 62.18,18.9 R19.2
PARKINB-IN
  Top 0.152: R19.1 60.24,18.8 R21.2 59.22,15.85 54.86,15.85 J9.1 53.34,12.34 53.19,12.19 38.13,12.19 36.73,10.79 36.73,7.12 31.75,2.13 16.92,2.13 16.13,2.92 U$1.P20-15
PIN20
  Top 0.152: U$1.P20-18 28.45,5.94 34.26,5.94 35.81,7.49 35.81,10.97
PLMECH
  Bottom 1.27: D10.2 30.1,11.79 U$1.P20-9
  pour Top (no thermals): 30.8,14.99 30.67,15.11 30.54,15.24 28.89,15.24 28.64,14.99 28.64,11.3 29.4,10.54 30.67,10.54 31.31,11.18 31.43,11.3 31.43,11.81 31.43,13.21 30.92,13.72 30.86,13.78 30.86,14.92
PLMECHSOL-IC  (via drill 0.25)
  Top 0.152: Q9.4 31.18,14.67 v31.62,15.11 | v32.55,18.07 33.12,18.64 35.66,18.64 | 35.66,18.64 39.47,18.64 44.29,23.47 70.35,23.47 73.3,26.42 73.3,41.76 71.22,43.84 U1.36 | R9.1 35.66,18.64
  Bottom 0.152: v31.62,15.11 31.62,17.78 31.92,18.07 v32.55,18.07
PLOCKSOL-IC  (via drill 0.25)  (1 unrouted)
  Top 0.152: v3.81,15.62 3.16,14.97 Q1.4 3.66,13.92 3.66,11.12 3.35,10.82 3.35,5.79 3.06,5.5 U$5.P$1 | v3.81,18.92 4.55,19.66 10.39,19.66 10.54,19.81 13.57,19.81 13.87,20.12 17,20.12 17.3,20.42 18.75,20.42 v19.2,20.88 | v23.93,21.34 24.36,20.9 27.01,20.9 27.36,21.26 29.39,21.26 29.56,21.08 38.46,21.08 43.28,25.91 48.77,25.91 49.99,27.13 49.99,31.85 49.38,32.46 48.78,32.46 U1.12
  Bottom 0.152: v3.81,15.62 v3.81,18.92 | v19.2,20.88 23.47,20.88 v23.93,21.34
PLSOL
  Bottom 1.27: U$1.P20-1 2.11,14.51 D2.2
  pour Top (no thermals): 2.79,14.99 2.67,15.11 2.54,15.24 0.89,15.24 0.64,14.99 0.64,11.3 1.4,10.54 2.67,10.54 3.3,11.18 3.43,11.3 3.43,11.81 3.43,13.21 2.92,13.72 2.86,13.78 2.86,14.92
RX  (1 unrouted)
SDA  (1 unrouted)
SHIFTDOWN  (1 unrouted)
SHIFTDOWN-IN  (1 unrouted)
  Top 0.152: U$1.P12-9 65.28,9.8 66.6,11.12 66.6,12.5 68.28,14.17 73.65,14.17 R17.2
SHIFTUP  (1 unrouted)
SHIFTUP-IN
  Top 0.152: U$1.P12-3 68.02,14.48 72.69,14.48 73.15,14.94 73.15,16.61 73.66,17.12 R14.2 76.05,18.02 76.05,19.24 R7.1
TCCSOL
  Bottom 1.27: D4.2 9.14,11.76 U$1.P20-3
  pour Top (no thermals): 9.65,14.99 9.53,15.11 9.4,15.24 7.75,15.24 7.49,14.99 7.49,11.3 8.26,10.54 9.53,10.54 10.16,11.18 10.29,11.3 10.29,11.81 10.29,13.21 9.78,13.72 9.72,13.78 9.72,14.92
TCCSOL-IC  (via drill 0.25)
  Top 0.152: v10.79,15.62 10.07,14.9 Q3.4 10.67,13.82 10.67,10.97 9.91,10.21 7.16,10.21 6.86,9.91 4.72,9.91 3.96,9.14 3.96,5.47 4.06,5.38 U$5.P$5 | v10.79,18.95 11.05,19.2 13.82,19.2 14.13,19.51 17.25,19.51 17.55,19.81 20.63,19.81 21.11,20.3 27.26,20.3 27.62,20.65 29.13,20.65 29.31,20.47 38.71,20.47 43.53,25.3 45.41,25.3 45.57,25.3 52.73,25.3 53.34,25.91 53.34,28.33 53.33,28.34 U1.16
  Bottom 0.152: v10.79,15.62 v10.79,18.95
TEMP  (1 unrouted)
  Top 0.152: R11.2 C1.1
TEMP-IN
  Top 0.152: U$1.P20-19 31.65,6.25 34.14,6.25 35.51,7.62 35.51,14.02 38.84,17.35 C2.1 44.95,18.9 R10.1 44.97,20.42 R11.1
TX  (1 unrouted)
USBPWR  (1 unrouted)
VIN  (via drill 0.5)
  Top 0.152: R5.P$2 20.7,21.46 20.19,21.97 20.19,23.11 19.73,23.58 U$4.8
  Top 0.203: R13.2 29.25,35.65 29.84,35.05 29.84,32.47 C6.1 30.06,31.71 29.21,30.86 29.21,29.72 28.49,29 R12.1 | C4.1 26.44,24.17 C5.1
  Top 0.254: v24,22.86 25.31,24.17 C5.1
  Top 0.406: R12.1 28.19,27.57 C3.1 | C4.1 C3.1 | C3.1 27.86,27.63 IC1.8
  Top 1.27: v24,22.86 v22.86,22.86 v21.84,22.86 21.84,21.84 R5.P$2
  Bottom 1.016: v24,22.86 21.72,22.86
  Bottom 1.27: U$1.P12-1 47.45,11.73 36.32,22.86 v24,22.86
  pour Top (no thermals): 20.32,21.97 20.45,21.97 20.45,22.35 21.46,23.37 21.59,23.5 22.86,23.5 22.99,23.37 23.11,23.24 23.11,21.97 23.11,20.95 22.99,20.83 21.46,20.83
VSSA  (1 unrouted)
VSSA-IN
  Top 0.152: U$1.P20-17 25.25,5.64 34.39,5.64 36.12,7.37 36.12,11.05 37.87,12.8 47.55,12.8 47.85,13.11 J7.1 50.32,16.79 R1.2 R2.2
VSSB  (1 unrouted)
VSSB-IN  (1 unrouted)
  Top 0.152: U$1.P20-16 22.05,5.33 34.52,5.33 36.42,7.24 36.42,10.92 38,12.5 49.99,12.5 50.44,12.95 J8.1 50.44,14.78 51.51,15.85 53.96,15.85 R3.2

### Text on the board
tNames: trendsetter / dave strum / 2/8/2021